# Altium project LAUNCHXL-F28379D_REV2.0.PrjPcb (part 2 of 2)

## Sheet P06_BoosterPack Headers.SchDoc
size 301 x 239 mm
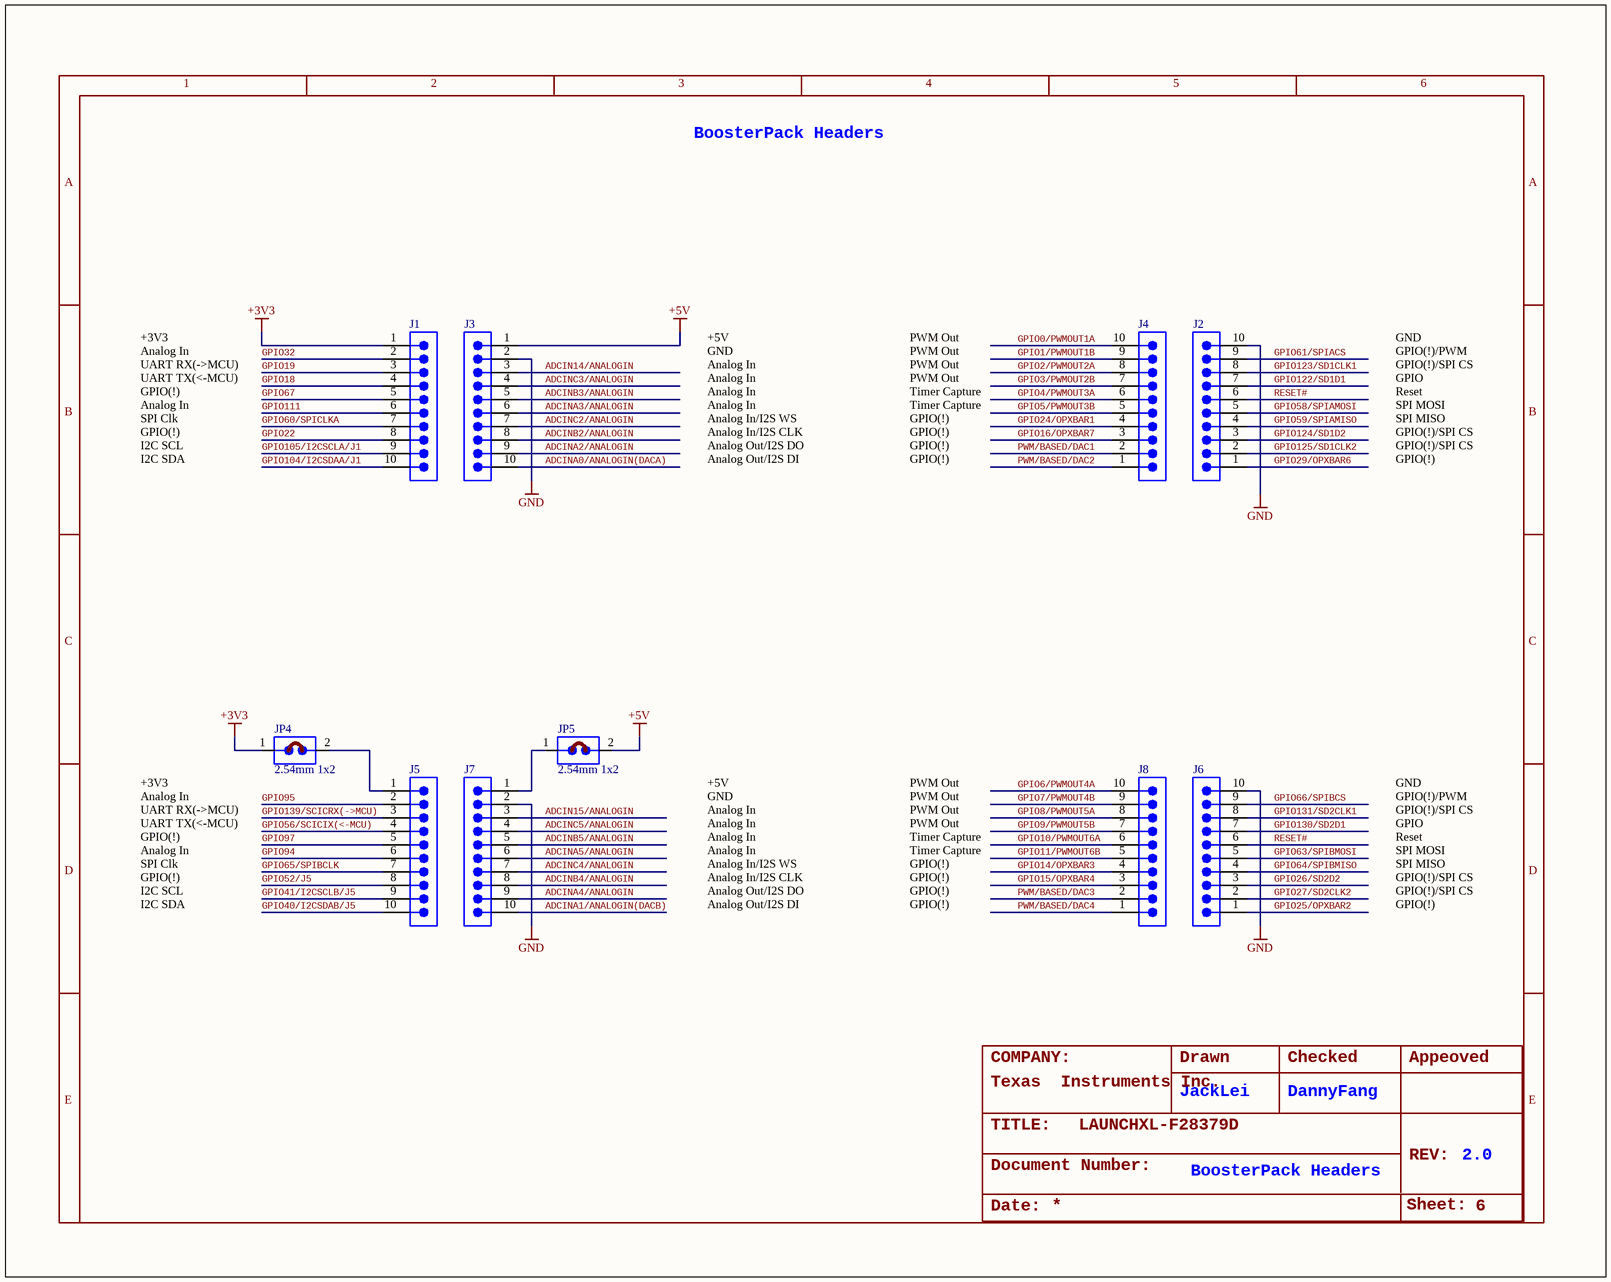
[diagram p8: P06_BoosterPack Headers.SchDoc]

### Parts
J1  FH2543-10GT10  [SOKV2W64P254_1X10_2590X250X850P]  (value not drawn)
J2  FH2543-10GT10  [SOKV2W64P254_1X10_2590X250X850P]  (value not drawn)
J3  FH2543-10GT10  [SOKV2W64P254_1X10_2590X250X850P]  (value not drawn)
J4  FH2543-10GT10  [SOKV2W64P254_1X10_2590X250X850P]  (value not drawn)
J5  FH2543-10GT10  [SOKV2W64P254_1X10_2590X250X850P]  (value not drawn)
J6  FH2543-10GT10  [SOKV2W64P254_1X10_2590X250X850P]  (value not drawn)
J7  FH2543-10GT10  [SOKV2W64P254_1X10_2590X250X850P]  (value not drawn)
J8  FH2543-10GT10  [SOKV2W64P254_1X10_2590X250X850P]  (value not drawn)
JP4  value 2.54mm 1x2  [HDRV2W64P254_1X2_508X250X850P]  (hidden comment: P6E02A-602530-B1)
JP5  value 2.54mm 1x2  [HDRV2W64P254_1X2_508X250X850P]  (hidden comment: P6E02A-602530-B1)
U$12  ROY_JUMPER  [ROY_JUMPER]  (value not drawn)
U$13  ROY_JUMPER  [ROY_JUMPER]  (value not drawn)

### Nets
+3V3: J1.1 JP4.1
+5V: J3.1 JP5.2
GND: J2.10 J3.2 J6.10 J7.2
ADCIN14/ANALOGIN: J3.3
ADCIN15/ANALOGIN: J7.3
ADCINA0/ANALOGIN(DACA): J3.10
ADCINA1/ANALOGIN(DACB): J7.10
ADCINA2/ANALOGIN: J3.9
ADCINA3/ANALOGIN: J3.6
ADCINA4/ANALOGIN: J7.9
ADCINA5/ANALOGIN: J7.6
ADCINB2/ANALOGIN: J3.8
ADCINB3/ANALOGIN: J3.5
ADCINB4/ANALOGIN: J7.8
ADCINB5/ANALOGIN: J7.5
ADCINC2/ANALOGIN: J3.7
ADCINC3/ANALOGIN: J3.4
ADCINC4/ANALOGIN: J7.7
ADCINC5/ANALOGIN: J7.4
GPIO0/PWMOUT1A: J4.10
GPIO1/PWMOUT1B: J4.9
GPIO2/PWMOUT2A: J4.8
GPIO3/PWMOUT2B: J4.7
GPIO4/PWMOUT3A: J4.6
GPIO5/PWMOUT3B: J4.5
GPIO6/PWMOUT4A: J8.10
GPIO7/PWMOUT4B: J8.9
GPIO8/PWMOUT5A: J8.8
GPIO9/PWMOUT5B: J8.7
GPIO10/PWMOUT6A: J8.6
GPIO11/PWMOUT6B: J8.5
GPIO14/OPXBAR3: J8.4
GPIO15/OPXBAR4: J8.3
GPIO16/OPXBAR7: J4.3
GPIO18: J1.4
GPIO19: J1.3
GPIO22: J1.8
GPIO24/OPXBAR1: J4.4
GPIO25/OPXBAR2: J6.1
GPIO26/SD2D2: J6.3
GPIO27/SD2CLK2: J6.2
GPIO29/OPXBAR6: J2.1
GPIO32: J1.2
GPIO40/I2CSDAB/J5: J5.10
GPIO41/I2CSCLB/J5: J5.9
GPIO52/J5: J5.8
GPIO56/SCICIX(<-MCU): J5.4
GPIO58/SPIAMOSI: J2.5
GPIO59/SPIAMISO: J2.4
GPIO60/SPICLKA: J1.7
GPIO61/SPIACS: J2.9
GPIO63/SPIBMOSI: J6.5
GPIO64/SPIBMISO: J6.4
GPIO65/SPIBCLK: J5.7
GPIO66/SPIBCS: J6.9
GPIO67: J1.5
GPIO94: J5.6
GPIO95: J5.2
GPIO97: J5.5
GPIO104/I2CSDAA/J1: J1.10
GPIO105/I2CSCLA/J1: J1.9
GPIO111: J1.6
GPIO122/SD1D1: J2.7
GPIO123/SD1CLK1: J2.8
GPIO124/SD1D2: J2.3
GPIO125/SD1CLK2: J2.2
GPIO130/SD2D1: J6.7
GPIO131/SD2CLK1: J6.8
GPIO139/SCICRX(->MCU): J5.3
PWM/BASED/DAC1: J4.2
PWM/BASED/DAC2: J4.1
PWM/BASED/DAC3: J8.2
PWM/BASED/DAC4: J8.1
RESET#: J2.6 J6.6
NetJ5_1: J5.1 JP4.2
NetJ7_1: J7.1 JP5.1

### Notes on the sheet
- BoosterPack Headers
- +3V3
- Analog In
- +5V
- GND
- PWM Out
- GPIO(!)/PWM
- UART RX(->MCU)
- UART TX(<-MCU)
- GPIO(!)
- SPI Clk
- Analog In/I2S WS
- Timer Capture
- GPIO(!)/SPI CS
- GPIO
- Reset
- SPI MOSI
- SPI MISO
- I2C SCL
- I2C SDA
- Analog In/I2S CLK
- Analog Out/I2S DO
- Analog Out/I2S DI
- COMPANY:
- Texas
  Instruments Inc.
- JackLei
- Drawn
- Checked
- DannyFang
- Appeoved
- TITLE:
- Document Number:
- LAUNCHXL-F28379D
- REV:
- 2.0
- Date:
- Sheet:
- 6
- 1
- 2
- 3
- 4
- 5
- A
- B
- C
- D
- E

### Library data of the parts
J1-J8 = 1009002200006: Connector,Pin Socket,Straight,Female,1x10Pin,2.54MM pitch,8.5,3.2,Gold Flash 1u,black,DIP; Manufacturer: MTCONN; Value: 2.54mm 1x10; Embest PN: 1009002200006; Part Type: Pin Socket; Manufacturer Part Number: FH2543-10GT10
JP4 JP5 = 1009001200003: Connector,Pin Header,Straight,Male,1x2Pin,2.54MM pitch,6.00,3.00,Gold Flash 1u, black,DIP,alt_code:15071705; Manufacturer: CHIN-BAN; Embest PN: 1009001200003; Part Type: Pin Header; Manufacturer Part Number: P6E02A-602530-B1

## Sheet P10_EX-Headers.SchDoc
size 301 x 239 mm
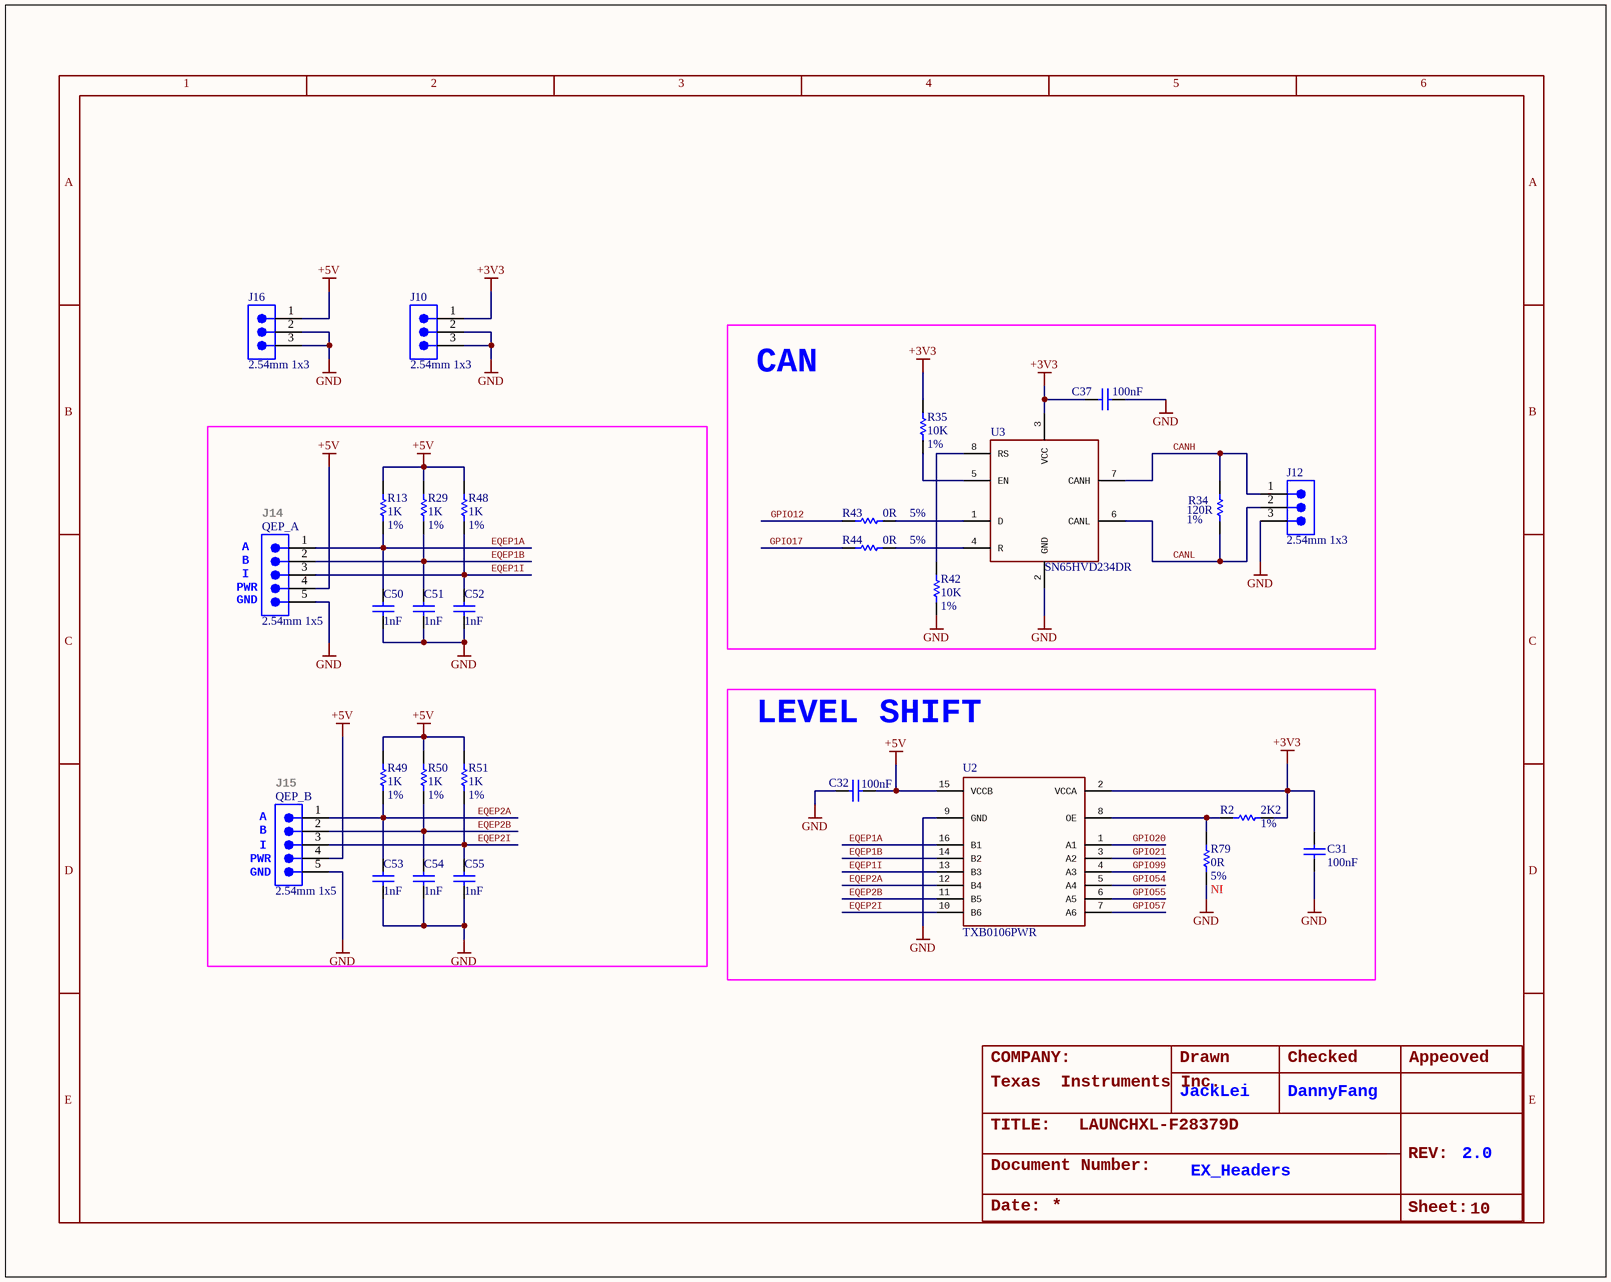
[diagram p9: P10_EX-Headers.SchDoc]

### Parts
C31  100nF  [C0402]
C32  100nF  [C0402]
C37  100nF  [C0402]
C50  1nF  [C0402]
C51  1nF  [C0402]
C52  1nF  [C0402]
C53  1nF  [C0402]
C54  1nF  [C0402]
C55  1nF  [C0402]
J10  value 2.54mm 1x3  [HDRV3W64P254_1X3_762X250X850P]  (hidden comment: P6E03A-602530-B1)
J12  value 2.54mm 1x3  [HDRV3W64P254_1X3_762X250X850P]  (hidden comment: P6E03A-602530-B1)
J16  value 2.54mm 1x3  [HDRV3W64P254_1X3_762X250X850P]  (hidden comment: P6E03A-602530-B1)
QEP_A  value 2.54mm 1x5  [HDRV5W64P254_1X5_1270X250X850P]  (hidden comment: P101-1*05SGF-116A-NX)
QEP_B  value 2.54mm 1x5  [HDRV5W64P254_1X5_1270X250X850P]  (hidden comment: P101-1*05SGF-116A-NX)
R2  Rating: 1%  [R0402]  (hidden comment: 2K2)
R13  Rating: 1%  [R0402]  (hidden comment: 1K)
R29  Rating: 1%  [R0402]  (hidden comment: 1K)
R34  Rating: 1%  [R0603]  (hidden comment: 120R)
R35  Rating: 1%  [R0402]  (hidden comment: 10K)
R42  Rating: 1%  [R0402]  (hidden comment: 10K)
R43  Rating: 5%  [R0402]  (hidden comment: 0R)
R44  Rating: 5%  [R0402]  (hidden comment: 0R)
R48  Rating: 1%  [R0402]  (hidden comment: 1K)
R49  Rating: 1%  [R0402]  (hidden comment: 1K)
R50  Rating: 1%  [R0402]  (hidden comment: 1K)
R51  Rating: 1%  [R0402]  (hidden comment: 1K)
R79  Rating: 5%  ASSY: NI  [R0603]  (hidden comment: 0R)
U2  TXB0106PWR  [TSSOP65P640X120-16N]
U3  SN65HVD234DR  [SOIC127P600X175-8N]

### Blocks framed on the sheet
CAN: C37 J12 R34 R35 R42-R44 U3
LEVEL SHIFT: C31 C32 R2 R79 U2

### Nets
+3V3: C31.1 C37.2 J10.1 R2.1 R35.2 U2.2(VCCA) U3.3(VCC)
+5V: C32.2 J16.1 QEP_A.4 QEP_B.4 R13.1 R29.1 R48.1 R49.1 R50.1 R51.1 U2.15(VCCB)
GND: C31.2 C32.1 C37.1 C50.1 C51.1 C52.1 C53.1 C54.1 C55.1 J10.2 J10.3 J12.3 J16.2 J16.3 QEP_A.5 QEP_B.5 R42.2 R79.2 U2.9(GND) U3.2(GND)
CANH: J12.1 R34.2 U3.7(CANH)
CANL: J12.2 R34.1 U3.6(CANL)
EQEP1A: C50.2 QEP_A.1 R13.2 U2.16(B1)
EQEP1B: C51.2 QEP_A.2 R29.2 U2.14(B2)
EQEP1I: C52.2 QEP_A.3 R48.2 U2.13(B3)
EQEP2A: C53.2 QEP_B.1 R49.2 U2.12(B4)
EQEP2B: C54.2 QEP_B.2 R50.2 U2.11(B5)
EQEP2I: C55.2 QEP_B.3 R51.2 U2.10(B6)
GPIO12: R43.2
GPIO17: R44.2
GPIO20: U2.1(A1)
GPIO21: U2.3(A2)
GPIO54: U2.5(A4)
GPIO55: U2.6(A5)
GPIO57: U2.7(A6)
GPIO99: U2.4(A3)
NetR2_2: R2.2 R79.1 U2.8(OE)
NetR35_1: R35.1 U3.5(EN)
NetR42_1: R42.1 U3.8(RS)
NetR43_1: R43.1 U3.1(D)
NetR44_1: R44.1 U3.4(R)

### Notes on the sheet
- (near QEP_A) A
- (near QEP_A) J14
- (near QEP_A) GND
- (near QEP_A) PWR
- (near QEP_A) B
- (near QEP_A) I
- (near QEP_B) A
- (near QEP_B) J15
- (near QEP_B) GND
- (near QEP_B) PWR
- (near QEP_B) B
- (near QEP_B) I
- COMPANY:
- Texas
  Instruments Inc.
- JackLei
- Drawn
- Checked
- DannyFang
- Appeoved
- TITLE:
- Document Number:
- LAUNCHXL-F28379D
- REV:
- 2.0
- Date:
- EX_Headers
- Sheet:
- 10
- 1
- 2
- 3
- 4
- 5
- 6
- C
- D
- E

### Library data of the parts
C31 C32 C37 = 1004001100187: CAP,100NF(0.1uf),+/-10%,X5R,10V,SMD0402; Manufacturer: MURATA; Manufacturer Part Number: GRM155R61A104KA01D; Rating: 10%; Embest PN: 1004001100187; Value: 100nF; Part Type: Ceramic Capacitor
C50-C55 = 1004001100030: CAP,1NF,+/-10%,X7R,50V,SMD0402; Manufacturer: MURATA; Manufacturer Part Number: GRM155R71H102KA01D; Rating: 10%; Embest PN: 1004001100030; Value: 1nF; Part Type: Ceramic Capacitor
J10 J12 J16 = 1009001200009: Connector,Pin Header,Straight,Male,1x3Pin,2.54MM pitch,6.00,3.00,Gold Flash 1u, black,DIP,alt_code:15071706; Manufacturer: CHIN-BAN; Embest PN: 1009001200009; Part Type: Pin Header; Manufacturer Part Number: P6E03A-602530-B1
QEP_A QEP_B = 1009001200016: Connector,Pin Header,Straight,Male,1x5Pin,2.54MM pitch,6.06,3.00,Gold Flash 1u, black,DIP; Manufacturer: TOWNES; Embest PN: 1009001200016; Part Type: Pin Header; Manufacturer Part Number: P101-1*05SGF-116A-NX
R2 = 1003001100045: RES,2K2,+/-1%,1/16W,SMD0402; Manufacturer: YAGEO; Manufacturer Part Number: RC0402FR-072K2L; Embest PN: 1003001100045; Value: 2K2; Part Type: Thick film Resistor
R13 R29 R48-R51 = 1003001100034: RES,1K,+/-1%,1/16W,SMD0402; Manufacturer: YAGEO; Manufacturer Part Number: RC0402FR-071KL; Embest PN: 1003001100034; Value: 1K; Part Type: Thick film Resistor
R34 = 1003001100187: RES,120R,+/-1%,1/10W,SMD0603; Manufacturer: YAGEO; Manufacturer Part Number: RC0603FR-07120RL; Embest PN: 1003001100187; Value: 120R; Part Type: Thick film Resistor
R35 R42 = 1003001100071: RES,10K,+/-1%,1/16W,SMD0402; Manufacturer: YAGEO; Manufacturer Part Number: RC0402FR-0710KL; Embest PN: 1003001100071; Value: 10K; Part Type: Thick film Resistor
R43 R44 = 1003001100001: RES,0R,+/-5%,1/16W,SMD0402; Manufacturer: YAGEO; Manufacturer Part Number: RC0402JR-070RL; Embest PN: 1003001100001; Value: 0R; Part Type: Thick film Resistor
R79 = 1003001100161: RES,0R,+/-5%,1/10W,SMD0603; Manufacturer: YAGEO; Manufacturer Part Number: RC0603JR-070RL; Embest PN: 1003001100161; Value: 0R; Part Type: Thick film Resistor
U2 = 1002008100038C: IC, 6-BIT BIDIRECTIONAL VOLTAGE-LEVEL TRANSLATOR WITH AUTO-DIRECTION SENSING AND ±15-kV ESD PROTECTION, TXB0106PWR, TSSOP-16, SMD,Cusomer Supply; Manufacturer: TI; Embest PN: 1002008100038C; Value: TXB0106PWR; Part Type: Logic; Manufacturer Part Number: TXB0106PWR
U3 = 1002010100117C: IC CAN TRANSCEIVER 3.3V 8-SOIC; Manufacturer: TI; Embest PN: 1002010100117C; Value: SN65HVD234DR; Part Type: Interface; Manufacturer Part Number: SN65HVD234DR

## Nets that join several sheets
+3V3: P02_XDS100v2 (8 pins), P03_Power (13 pins), P04_ADCIND (C83.2 U1.3 U1.7), P05_PWM-DAC (C24.2 R38.2 R39.2 U9.5), P07_F28379D-PWR (8 pins), P09_F28379D-IO2 (J9.52 J9.53 J9.56 J9.57), P06_BoosterPack Headers (J1.1 JP4.1), P10_EX-Headers (7 pins)
+5V: P02_XDS100v2 (JP3.2), P03_Power (8 pins), P06_BoosterPack Headers (J3.1 JP5.2), P10_EX-Headers (11 pins)
GND: P02_XDS100v2 (6 pins), P03_Power (56 pins), P04_ADCIND (24 pins), P05_PWM-DAC (6 pins), P07_F28379D-PWR (86 pins), P09_F28379D-IO2 (6 pins), P06_BoosterPack Headers (J2.10 J3.2 J6.10 J7.2), P10_EX-Headers (20 pins)
VDD: P03_Power (11 pins), P07_F28379D-PWR (14 pins)
VDDA: P03_Power (C27.2 C28.2 C30.2 L3.2), P07_F28379D-PWR (U14.P6 U14.R6)
VDDIO: P03_Power (15 pins), P07_F28379D-PWR (29 pins)
VDDOSC: P03_Power (C71.2 C73.2 C74.2 L4.2), P07_F28379D-PWR (U14.H16 U14.H17)
ADCIN14/ANALOGIN: P09_F28379D-IO2 (U14.T4), P06_BoosterPack Headers (J3.3)
ADCIN15/ANALOGIN: P09_F28379D-IO2 (U14.U4), P06_BoosterPack Headers (J7.3)
ADCINA0/ANALOGIN(DACA): P09_F28379D-IO2 (U14.U1), P06_BoosterPack Headers (J3.10)
ADCINA1/ANALOGIN(DACB): P09_F28379D-IO2 (U14.T1), P06_BoosterPack Headers (J7.10)
ADCINA2/ANALOGIN: P09_F28379D-IO2 (U14.U2), P06_BoosterPack Headers (J3.9)
ADCINA3/ANALOGIN: P09_F28379D-IO2 (U14.T2), P06_BoosterPack Headers (J3.6)
ADCINA4/ANALOGIN: P09_F28379D-IO2 (U14.U3), P06_BoosterPack Headers (J7.9)
ADCINA5/ANALOGIN: P09_F28379D-IO2 (U14.T3), P06_BoosterPack Headers (J7.6)
ADCINB2/ANALOGIN: P09_F28379D-IO2 (U14.V3), P06_BoosterPack Headers (J3.8)
ADCINB3/ANALOGIN: P09_F28379D-IO2 (U14.W3), P06_BoosterPack Headers (J3.5)
ADCINB4/ANALOGIN: P09_F28379D-IO2 (U14.V4), P06_BoosterPack Headers (J7.8)
ADCINB5/ANALOGIN: P09_F28379D-IO2 (U14.W4), P06_BoosterPack Headers (J7.5)
ADCINC2/ANALOGIN: P09_F28379D-IO2 (U14.R3), P06_BoosterPack Headers (J3.7)
ADCINC3/ANALOGIN: P09_F28379D-IO2 (U14.P3), P06_BoosterPack Headers (J3.4)
ADCINC4/ANALOGIN: P09_F28379D-IO2 (U14.R4), P06_BoosterPack Headers (J7.7)
ADCINC5/ANALOGIN: P09_F28379D-IO2 (U14.P4), P06_BoosterPack Headers (J7.4)
ADCIND0: P04_ADCIND (J21.1), P09_F28379D-IO2 (U14.T5)
ADCIND1: P04_ADCIND (J21.3), P09_F28379D-IO2 (U14.U5)
ADCIND2: P04_ADCIND (J21.5), P09_F28379D-IO2 (U14.T6)
ADCIND3: P04_ADCIND (J21.7), P09_F28379D-IO2 (U14.U6)
ADCIND4: P04_ADCIND (C40.2 R58.1), P09_F28379D-IO2 (U14.T7)
ADCIND5: P04_ADCIND (C40.1 R65.1), P09_F28379D-IO2 (U14.U7)
GPIO0/PWMOUT1A: P09_F28379D-IO2 (U14.C8), P06_BoosterPack Headers (J4.10)
GPIO1/PWMOUT1B: P09_F28379D-IO2 (U14.D8), P06_BoosterPack Headers (J4.9)
GPIO2/PWMOUT2A: P09_F28379D-IO2 (U14.A7), P06_BoosterPack Headers (J4.8)
GPIO3/PWMOUT2B: P09_F28379D-IO2 (U14.B7), P06_BoosterPack Headers (J4.7)
GPIO4/PWMOUT3A: P09_F28379D-IO2 (U14.C7), P06_BoosterPack Headers (J4.6)
GPIO5/PWMOUT3B: P09_F28379D-IO2 (U14.D7), P06_BoosterPack Headers (J4.5)
GPIO6/PWMOUT4A: P09_F28379D-IO2 (U14.A6), P06_BoosterPack Headers (J8.10)
GPIO7/PWMOUT4B: P09_F28379D-IO2 (U14.B6), P06_BoosterPack Headers (J8.9)
GPIO8/PWMOUT5A: P09_F28379D-IO2 (U14.G2), P06_BoosterPack Headers (J8.8)
GPIO9/PWMOUT5B: P09_F28379D-IO2 (U14.G3), P06_BoosterPack Headers (J8.7)
GPIO10/PWMOUT6A: P09_F28379D-IO2 (U14.B2), P06_BoosterPack Headers (J8.6)
GPIO11/PWMOUT6B: P09_F28379D-IO2 (U14.C1), P06_BoosterPack Headers (J8.5)
GPIO12: P09_F28379D-IO2 (U14.C2), P10_EX-Headers (R43.2)
GPIO14/OPXBAR3: P09_F28379D-IO2 (U14.D2), P06_BoosterPack Headers (J8.4)
GPIO15/OPXBAR4: P09_F28379D-IO2 (U14.D3), P06_BoosterPack Headers (J8.3)
GPIO16/OPXBAR7: P09_F28379D-IO2 (U14.E1), P06_BoosterPack Headers (J4.3)
GPIO17: P09_F28379D-IO2 (U14.E2), P10_EX-Headers (R44.2)
GPIO18: P09_F28379D-IO2 (U14.E3), P06_BoosterPack Headers (J1.4)
GPIO19: P09_F28379D-IO2 (U14.E4), P06_BoosterPack Headers (J1.3)
GPIO20: P09_F28379D-IO2 (U14.F2), P10_EX-Headers (U2.1)
GPIO21: P09_F28379D-IO2 (U14.F3), P10_EX-Headers (U2.3)
GPIO22: P09_F28379D-IO2 (U14.J4), P06_BoosterPack Headers (J1.8)
GPIO24/OPXBAR1: P09_F28379D-IO2 (U14.K3), P06_BoosterPack Headers (J4.4)
GPIO25/OPXBAR2: P09_F28379D-IO2 (U14.K2), P06_BoosterPack Headers (J6.1)
GPIO26/SD2D2: P09_F28379D-IO2 (U14.K1), P06_BoosterPack Headers (J6.3)
GPIO27/SD2CLK2: P09_F28379D-IO2 (U14.L1), P06_BoosterPack Headers (J6.2)
GPIO29/OPXBAR6: P09_F28379D-IO2 (R75.2), P06_BoosterPack Headers (J2.1)
GPIO31: P05_PWM-DAC (U9.3), P09_F28379D-IO2 (J9.45 U14.U11)
GPIO32: P09_F28379D-IO2 (J9.59 U14.U13), P06_BoosterPack Headers (J1.2)
GPIO34: P05_PWM-DAC (U9.1), P09_F28379D-IO2 (J9.43 U14.U14)
GPIO40/I2CSDAB/J5: P09_F28379D-IO2 (R67.2), P06_BoosterPack Headers (J5.10)
GPIO41/I2CSCLB/J5: P09_F28379D-IO2 (R69.2), P06_BoosterPack Headers (J5.9)
GPIO42/SCIATX(<-MCU): P02_XDS100v2 (R30.2 U7.4), P09_F28379D-IO2 (U14.D19)
GPIO43/SCIARX(->MCU): P02_XDS100v2 (R16.2 U5.11), P09_F28379D-IO2 (U14.C19)
GPIO52: P08_F28379D-IO1 (U14.P16), P09_F28379D-IO2 (R77.1 R78.1)
GPIO52/J5: P09_F28379D-IO2 (R77.2), P06_BoosterPack Headers (J5.8)
GPIO54: P08_F28379D-IO1 (U14.P18), P10_EX-Headers (U2.5)
GPIO55: P08_F28379D-IO1 (U14.P19), P10_EX-Headers (U2.6)
GPIO56/SCICIX(<-MCU): P08_F28379D-IO1 (U14.N16), P06_BoosterPack Headers (J5.4)
GPIO57: P08_F28379D-IO1 (U14.N18), P10_EX-Headers (U2.7)
GPIO58/SPIAMOSI: P08_F28379D-IO1 (U14.N17), P06_BoosterPack Headers (J2.5)
GPIO59/SPIAMISO: P08_F28379D-IO1 (U14.M16), P06_BoosterPack Headers (J2.4)
GPIO60/SPICLKA: P08_F28379D-IO1 (U14.M17), P06_BoosterPack Headers (J1.7)
GPIO61/SPIACS: P08_F28379D-IO1 (U14.L16), P06_BoosterPack Headers (J2.9)
GPIO63/SPIBMOSI: P08_F28379D-IO1 (U14.J16), P06_BoosterPack Headers (J6.5)
GPIO64/SPIBMISO: P08_F28379D-IO1 (U14.L17), P06_BoosterPack Headers (J6.4)
GPIO65/SPIBCLK: P08_F28379D-IO1 (U14.K16), P06_BoosterPack Headers (J5.7)
GPIO66/SPIBCS: P08_F28379D-IO1 (U14.K17), P06_BoosterPack Headers (J6.9)
GPIO67: P08_F28379D-IO1 (U14.B19), P06_BoosterPack Headers (J1.5)
GPIO69: P08_F28379D-IO1 (U14.B18), P09_F28379D-IO2 (J9.41)
GPIO70: P08_F28379D-IO1 (U14.A17), P09_F28379D-IO2 (J9.40)
GPIO71: P08_F28379D-IO1 (U14.B17), P09_F28379D-IO2 (J9.39)
GPIO72: P07_F28379D-PWR (R9.2 S1.2), P08_F28379D-IO1 (U14.B16), P09_F28379D-IO2 (J9.38)
GPIO73: P08_F28379D-IO1 (U14.A16), P09_F28379D-IO2 (J9.37)
GPIO74: P08_F28379D-IO1 (U14.C17), P09_F28379D-IO2 (J9.36)
GPIO75: P08_F28379D-IO1 (U14.D16), P09_F28379D-IO2 (J9.35)
GPIO76: P08_F28379D-IO1 (U14.C16), P09_F28379D-IO2 (J9.34)
GPIO77: P08_F28379D-IO1 (U14.A15), P09_F28379D-IO2 (J9.28)
GPIO78: P08_F28379D-IO1 (U14.B15), P09_F28379D-IO2 (J9.27)
GPIO79: P08_F28379D-IO1 (U14.C15), P09_F28379D-IO2 (J9.26)
GPIO80: P08_F28379D-IO1 (U14.D15), P09_F28379D-IO2 (J9.25)
GPIO81: P08_F28379D-IO1 (U14.A14), P09_F28379D-IO2 (J9.24)
GPIO82: P08_F28379D-IO1 (U14.B14), P09_F28379D-IO2 (J9.23)
GPIO83: P08_F28379D-IO1 (U14.C14), P09_F28379D-IO2 (J9.22)
GPIO84: P07_F28379D-PWR (R8.2 S1.1), P08_F28379D-IO1 (U14.A11)
GPIO85: P08_F28379D-IO1 (U14.B11), P09_F28379D-IO2 (J9.21)
GPIO86: P08_F28379D-IO1 (U14.C11), P09_F28379D-IO2 (J9.47)
GPIO87: P08_F28379D-IO1 (U14.D11), P09_F28379D-IO2 (J9.48)
GPIO88: P08_F28379D-IO1 (U14.C6), P09_F28379D-IO2 (J9.17)
GPIO89: P08_F28379D-IO1 (U14.D6), P09_F28379D-IO2 (J9.18)
GPIO92: P08_F28379D-IO1 (U14.A4), P09_F28379D-IO2 (J9.3)
GPIO93: P08_F28379D-IO1 (U14.B4), P09_F28379D-IO2 (J9.2)
GPIO94: P08_F28379D-IO1 (U14.A3), P06_BoosterPack Headers (J5.6)
GPIO95: P08_F28379D-IO1 (U14.B3), P06_BoosterPack Headers (J5.2)
GPIO97: P08_F28379D-IO1 (U14.A2), P06_BoosterPack Headers (J5.5)
GPIO99: P08_F28379D-IO1 (U14.G1), P10_EX-Headers (U2.4)
GPIO100: P08_F28379D-IO1 (U14.H1), P09_F28379D-IO2 (J9.32)
GPIO101: P08_F28379D-IO1 (U14.H2), P09_F28379D-IO2 (J9.33)
GPIO102: P08_F28379D-IO1 (U14.H3), P09_F28379D-IO2 (J9.31)
GPIO103: P08_F28379D-IO1 (U14.J1), P09_F28379D-IO2 (J9.30)
GPIO104/I2CSDAA: P08_F28379D-IO1 (U14.J2), P09_F28379D-IO2 (R71.1 R72.1)
GPIO104/I2CSDAA/J1: P09_F28379D-IO2 (R71.2), P06_BoosterPack Headers (J1.10)
GPIO105/I2CSCLA: P08_F28379D-IO1 (U14.J3), P09_F28379D-IO2 (R73.1 R74.1)
GPIO105/I2CSCLA/J1: P09_F28379D-IO2 (R73.2), P06_BoosterPack Headers (J1.9)
GPIO107: P08_F28379D-IO1 (U14.L3), P09_F28379D-IO2 (J9.49)
GPIO108: P08_F28379D-IO1 (U14.L4), P09_F28379D-IO2 (J9.60)
GPIO111: P08_F28379D-IO1 (U14.M4), P06_BoosterPack Headers (J1.6)
GPIO122/SD1D1: P08_F28379D-IO1 (U14.T8), P06_BoosterPack Headers (J2.7)
GPIO123/SD1CLK1: P08_F28379D-IO1 (U14.U8), P06_BoosterPack Headers (J2.8)
GPIO124/SD1D2: P08_F28379D-IO1 (U14.V8), P06_BoosterPack Headers (J2.3)
GPIO125/SD1CLK2: P08_F28379D-IO1 (U14.T9), P06_BoosterPack Headers (J2.2)
GPIO130/SD2D1: P08_F28379D-IO1 (U14.U10), P06_BoosterPack Headers (J6.7)
GPIO131/SD2CLK1: P08_F28379D-IO1 (U14.V10), P06_BoosterPack Headers (J6.8)
GPIO139/SCICRX(->MCU): P08_F28379D-IO1 (U14.N19), P06_BoosterPack Headers (J5.3)
GPIO157: P05_PWM-DAC (R40.1), P08_F28379D-IO1 (U14.B10)
GPIO158: P05_PWM-DAC (R41.1), P08_F28379D-IO1 (U14.C10)
GPIO159: P05_PWM-DAC (R36.1), P08_F28379D-IO1 (U14.D10)
GPIO160: P05_PWM-DAC (R37.1), P08_F28379D-IO1 (U14.B9)
JTAG_TRST: P02_XDS100v2 (R28.2 U7.5), P07_F28379D-PWR (S1.4)
PWM/BASED/DAC1: P05_PWM-DAC (C36.2 R36.2), P06_BoosterPack Headers (J4.2)
PWM/BASED/DAC2: P05_PWM-DAC (C33.2 R37.2), P06_BoosterPack Headers (J4.1)
PWM/BASED/DAC3: P05_PWM-DAC (C34.2 R40.2), P06_BoosterPack Headers (J8.2)
PWM/BASED/DAC4: P05_PWM-DAC (C35.2 R41.2), P06_BoosterPack Headers (J8.1)
RESET#: P07_F28379D-PWR (5 pins), P06_BoosterPack Headers (J2.6 J6.6)
TCK: P02_XDS100v2 (R20.2 U5.14), P07_F28379D-PWR (U14.V15)
TDI: P02_XDS100v2 (R19.2 U5.13), P07_F28379D-PWR (U14.W13)
TDO: P02_XDS100v2 (R32.2 U7.3), P07_F28379D-PWR (U14.W15)
TMS: P02_XDS100v2 (R18.2 U5.12), P07_F28379D-PWR (U14.W14)
VREF: P03_Power (C22.2 R3.1 U13.6), P04_ADCIND (R60.1)
VREFHIA: P03_Power (R11.2 U19.2 U19.6), P07_F28379D-PWR (U14.R1 U14.V1)
VREFHIB: P03_Power (R52.2 U11.2 U11.6), P07_F28379D-PWR (U14.V5 U14.W5)